# Altium schematic sheet Connectors.SchDoc: USB2RMP
size A4; Date: *******; ApprovedBy: *******; CheckedBy: Thomas Schaub; Author: *******; CompanyName: *******; DrawnBy: Kevin Schaerer; Engineer: *******; Organization: *******; Address1: *******; Address2: *******; Address3: *******; Address4: *******; DocumentNumber: Doc Num; Revision: 1.1; SheetNumber: 2; SheetTotal: 3; CurrentTime: *******; CurrentDate: *******; Time: *******; DocumentFullPathAndName: *******; DocumentName: *******; ModifiedDate: *******; ImagePath: *******; ProjectName: *******; Application_BuildNumber: *******
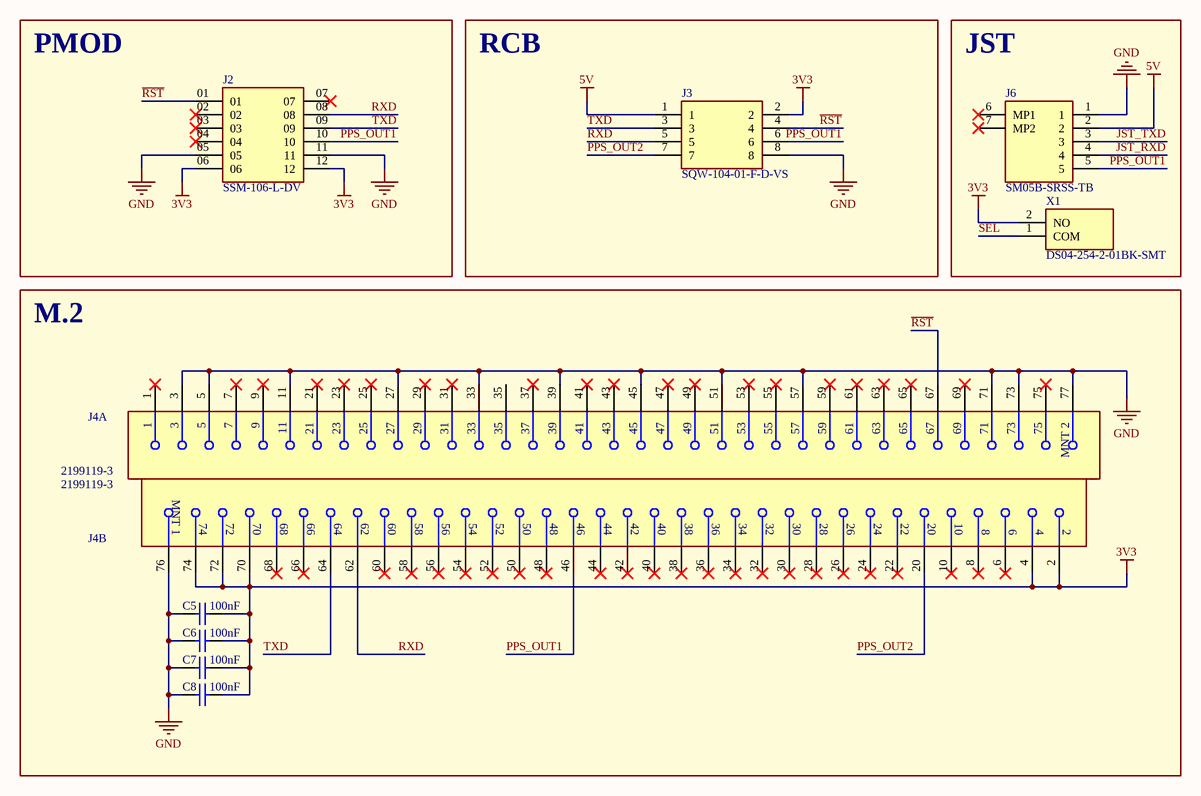
[diagram p0: Connectors.SchDoc]

## Parts
C5  value 100nF  [FP-C0603C-CF-MFG]  (hidden comment: C0603C104K4RACTU)
C6  value 100nF  [FP-C0603C-CF-MFG]  (hidden comment: C0603C104K4RACTU)
C7  value 100nF  [FP-C0603C-CF-MFG]  (hidden comment: C0603C104K4RACTU)
C8  value 100nF  [FP-C0603C-CF-MFG]  (hidden comment: C0603C104K4RACTU)
J2  SSM-106-L-DV  [SAMTEC_SSM-106-L-DV]
J3  SQW-104-01-F-D-VS  [SAMTEC-SQW-104-01-X-D-VS]
J4  2199119-3  [FP-2199119-3-MFG]  (parts A,B of 2)
J6  SM05B-SRSS-TB  [SM05BSRSSTBLFSN]
X1  DS04-254-2-01BK-SMT  [DS04254201BKSMTTR]

## Blocks framed on the sheet
PMOD: J2
RCB: J3
JST: J6 X1
M.2: C5-C8 J4

## Nets
3V3: C5.2 C6.2 C7.2 C8.2 J2.06 J2.12 J3.2 J4.2 J4.4 J4.70 J4.72 J4.74 X1.2(NO)
5V: J3.1 J6.2
GND: C5.1 C6.1 C7.1 C8.1 J2.05 J2.11 J3.8 J4.3 J4.5 J4.11 J4.27 J4.33 J4.39 J4.45 J4.51 J4.57 J4.71 J4.73 J4.76(MNT_1) J4.77(MNT_2) J6.1
~{RST}: J2.01 J3.4 J4.67
JST_RXD: J6.4
JST_TXD: J6.3
PPS_OUT1: J2.10 J3.6 J4.46 J6.5
PPS_OUT2: J3.7 J4.20
RXD: J2.08 J3.5 J4.62
SEL: X1.1(COM)
TXD: J2.09 J3.3 J4.64

Not connected (* = marked no-connect by the designer): J2 02* 03* 04* 07*; J4 1* 6* 7* 8* 9* 10* 21* 22* 23* 24* 25* 26* 28* 29* 30* 31* 32* 34* 35 36* 37* 38* 40* 41* 42* 43* 44* 47* 48* 49* 50* 52* 53* 54* 55* 56* 58* 59* 60* 61* 63* 65* 66* 68* 69* 75*; J6 6(MP1)* 7(MP2)*

## Notes on the sheet
- Title:
- Drawn By:
- Checked By:
- NetTimeLogic GmbH
- Badenerstrasse 595
- Size:
- Date:
- File:
- License:
- Email:
- A4
- conctact@nettimelogic.com <mailto:contact@nettimelogic.com>
- Revision:
- Sheet
- of
- Website:
- www.nettimelogic.com <http://www.nettimelogic.com>
- 8048 Zürich
- Switzerland

## Library data of the parts
C5-C8 = CMP-00009-15: Cap Ceramic 0.1uF 16V X7R 10% SMD 0603 125°C Paper T/R; Dissipation Factor: 3.5%; Contact Plating: Tin,Matte; Radiation Hardening: No; Max Operating Temperature: 125°C; Package Quantity: 4000; Voltage: 16V; Thickness: 0.034inch; Case Code (Metric): 1608; Length: 1.6mm; Voltage Rating: 16V; Case/Package: 0603; Packaging: Tape and Reel; Depth: 0.8mm; Reach SVHC Compliant: Yes; Tolerance: 10%; Case Code (Imperial): 0603; Pins: 2; Dielectric Material: Ceramic; Series: SMD Comm X7R; Voltage Rating (DC): 16V; Dielectric: X7R; Width: 0.8mm; Lead Pitch: 0.7mm; Mounting Technology: Surface Mount,PCB; Min Operating Temperature: -55°C; Weight: 7.1E-05oz; Construction: Flat; Height: 0.8mm; Termination: SMD/SMT
J2 = CMP-020-000000-6: Header Surface Mount (2.54mm) 2x6; MF: Samtec; Package: None; MP: SSM-106-L-DV; Value: *; Design Item ID: SSM-106-L-DV; Pin Count: 12; Component Type: Standard; Availability: Unavailable; Price: None; Source: SSM-106-L-DV.SchLib
J3 = CMP-199-000000-4: Headers & Wire Housings Cost Effective Rugged PCB Sockets, 2.00mm pitch; Price: None; Source: SAMTEC-SQW-104-01-X-D-VS.SchLib; MP: SAMTEC-SQW-104-01-X-D-VS; Component Type: Standard; Value: *; Design Item ID: SAMTEC-SQW-104-01-X-D-VS; Availability: Unavailable; Pin Count: 8; Package: None
J4 = CMP-002-00009-1: Conn Card Edge SKT 67 POS 0.5mm Solder RA SMD Embossed T/R
J6 = CMP-244-000000-2: Board Connector, 5 Contact(s), 1 Row(s), Male, Right Angle, Surface Mount Terminal; Manufacturer_Name: JST (JAPAN SOLDERLESS TERMINALS); Manufacturer_Part_Number: SM05B-SRSS-TB(LF)(SN); Voltage Rating: 50V; Pitch: 0.039inch; Number of Positions: 5; Contact Resistance: 40mR; Connector Type: Header; Max Current Rating: 1A; Insulation Resistance: 100MR; Geometry.Height: 2.95mm; Gender: Male; Min Operating Temperature: -25°C; Termination: Solder; Length: 7mm; Depth: 4.95mm; Series: SR; Mouser Part Number: *; Packaging: Cut Tape; Lead Free: Contains Lead; Contact Type: Male Pin; Contact Finish - Mating: TIN; Design Item ID: SM05B-SRSS-TB_LF__SN_; Orientation: Right Angle; Color: Natural; Mouser Price/Stock: *; Mounting Technology: Surface Mount; Contact Shape: Square; Housing Color: Natural; Datasheet Link: http://www.jst-mfg.com/product/pdf/eng/eSH.pdf; Material: Polyamide; Flammability Rating: UL94 V-0; Source: SM05B-SRSS-TB_LF__SN_.SchLib; Contact Material: Copper Alloy; Housing Material: Nylon; Number of Contacts: 5; Voltage Rating (AC): 50V; Max Voltage Rating (AC): 50V; Package Quantity: 1; Reach SVHC Compliant: No; Lead Pitch: 1mm; Insulation Color: Natural; Max Voltage Rating (DC): 50V; Fastening Type: Pull; Max Operating Temperature: 85°C; Current Rating: 1A; Number of Rows: 1; Insulation Material: Nylon; Contact Plating: Tin,Lead
X1 = CMP-247-000000-2: Switch DIP OFF ON SPST 1 Flat Slide 0.025A 24VDC Gull Wing 2.54mm SMD Tube; Manufacturer_Name: Same Sky; Voltage Rating (DC): 24V; Washable: No; Body Material: PBT,Polybutylene; Actuator Type: Slide (Standard); Switching Current: 25mA; Number of Positions: 1; Electrical Life: 2000Cycles; Geometry.Height: 4.3mm; Height: 3.66mm; Length: 3.54mm; Series: DS04-254-SMT; Contact Plating: Gold; Mouser Part Number: 490-DS04254201BK-STR; Switching Voltage: 24V; Source: DS04-254-2-01BK-SMT-TR.SchLib; Manufacturer_Part_Number: DS04-254-2-01BK-SMT-TR; Mouser Price/Stock: https://www.mouser.co.uk/ProductDetail/CUI-Devices/DS04-254-2-01BK-SMT-TR?qs=wnTfsH77Xs4xXRFXKF0ssg%3D%3D; Pitch: 2.54mm; Width: 6.2mm; Datasheet Link: https://www.cuidevices.com/product/resource/supplyframepdf/ds04-254-smt.pdf; Min Operating Temperature: -40°C; Max Operating Temperature: 85°C; Contact Material: Copper Alloy; Design Item ID: DS04-254-2-01BK-SMT-TR; Termination: Gull Wing; Throw Configuration: SPST; Mounting Technology: Surface Mount